# Altium project 18111C Ticketing.PrjPcb
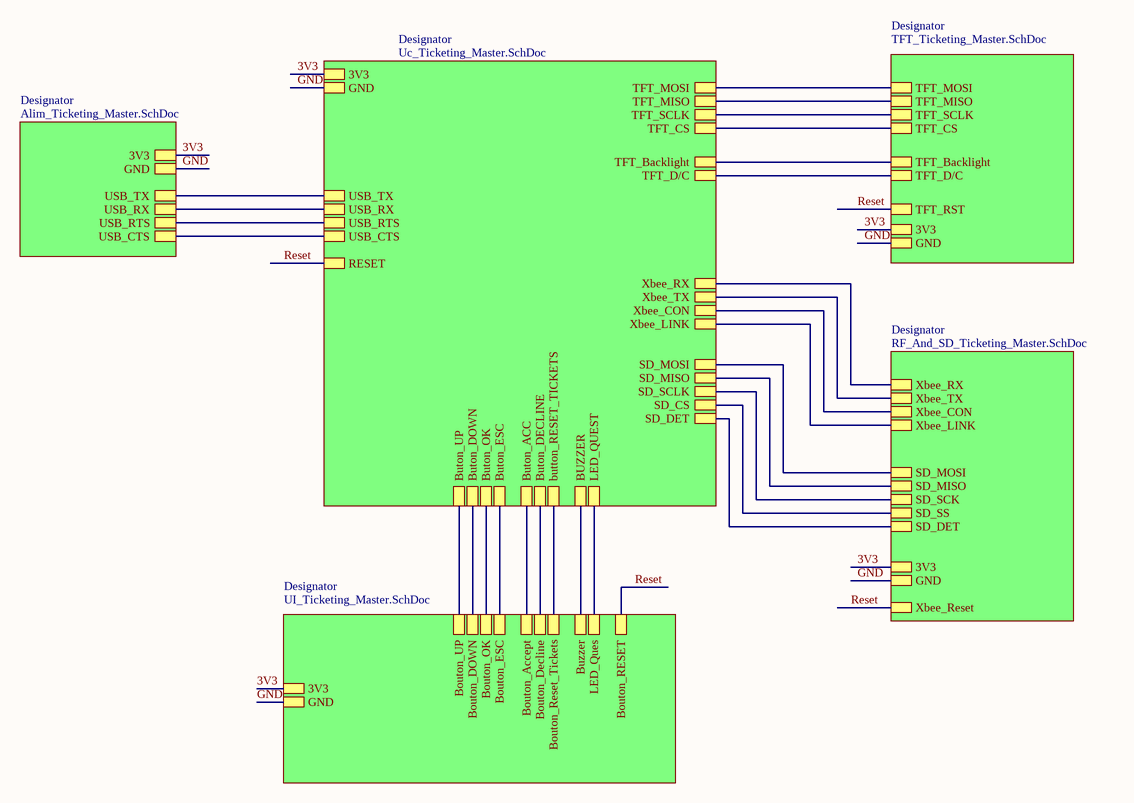
[diagram p0: Ticketing_Master.SchDoc]
6 sheets, 75 parts. Net scope: hierarchical (ports join the sheet entries above them; power ports are global).
Board file: PCB_Ticketing_Master.PcbDoc
Sheets:
  Ticketing_Master.SchDoc
    Designator = Alim_Ticketing_Master.SchDoc
    Designator = RF_And_SD_Ticketing_Master.SchDoc
    Designator = TFT_Ticketing_Master.SchDoc
    Designator = Uc_Ticketing_Master.SchDoc
    Designator = UI_Ticketing_Master.SchDoc

## Sheet Ticketing_Master.SchDoc
size A4; Author: Mario Dos Santos; Organization: ETML-ES; Address1: Avenue Recordon 1; Address2: 1004 Lausanne; Address3: Switzerland; SheetNumber: 1; SheetTotal: 6

### Sub-sheets
Designator = Alim_Ticketing_Master.SchDoc: 3V3, GND, USB_TX, USB_RX, USB_RTS, USB_CTS
Designator = RF_And_SD_Ticketing_Master.SchDoc: Xbee_RX, Xbee_TX, SD_MISO, Xbee_Reset, SD_SS, SD_MOSI, SD_SCK, Xbee_CON, Xbee_LINK, GND, 3V3, SD_DET
Designator = TFT_Ticketing_Master.SchDoc: TFT_MOSI, TFT_Backlight, TFT_CS, TFT_RST, TFT_D/C, TFT_MISO, TFT_SCLK, 3V3, GND
Designator = Uc_Ticketing_Master.SchDoc: 3V3, GND, SD_SCLK, TFT_SCLK, SD_MOSI, SD_MISO, Xbee_RX, Xbee_TX, TFT_MOSI, TFT_MISO, TFT_Backlight, SD_CS, TFT_CS, TFT_D/C, Xbee_CON, Xbee_LINK, Buton_UP, Buton_OK, Buton_ESC, Buton_DOWN, LED_QUEST, BUZZER, Buton_DECLINE, button_RESET_TICKETS, Buton_ACC, RESET, SD_DET, USB_TX, USB_RX, USB_RTS, USB_CTS
Designator = UI_Ticketing_Master.SchDoc: GND, 3V3, Buzzer, Bouton_Accept, Bouton_UP, Bouton_OK, LED_Ques, Bouton_ESC, Bouton_Decline, Bouton_Reset_Tickets, Bouton_DOWN, Bouton_RESET

### Nets
3V3: sheet Designator/3V3, sheet Designator/3V3, sheet Designator/3V3, sheet Designator/3V3, sheet Designator/3V3
GND: sheet Designator/GND, sheet Designator/GND, sheet Designator/GND, sheet Designator/GND, sheet Designator/GND
BackLight: sheet Designator/TFT_Backlight, sheet Designator/TFT_Backlight
Connect(M): sheet Designator/Xbee_CON, sheet Designator/Xbee_CON
CS: sheet Designator/TFT_CS, sheet Designator/TFT_CS
D/C: sheet Designator/TFT_D/C, sheet Designator/TFT_D/C
LED_Ques: sheet Designator/LED_QUEST, sheet Designator/LED_Ques
LINK(M): sheet Designator/Xbee_LINK, sheet Designator/Xbee_LINK
MISO: sheet Designator/TFT_MISO, sheet Designator/TFT_MISO
MOSI: sheet Designator/TFT_MOSI, sheet Designator/TFT_MOSI
Reset: sheet Designator/Xbee_Reset, sheet Designator/TFT_RST, sheet Designator/RESET, sheet Designator/Bouton_RESET
SCLK: sheet Designator/TFT_SCLK, sheet Designator/TFT_SCLK
USB_CTS: sheet Designator/USB_CTS, sheet Designator/USB_CTS
USB_RTS: sheet Designator/USB_RTS, sheet Designator/USB_RTS
USB_RX: sheet Designator/USB_RX, sheet Designator/USB_RX
USB_TX: sheet Designator/USB_TX, sheet Designator/USB_TX
Xbee_RX: sheet Designator/Xbee_RX, sheet Designator/Xbee_RX
Xbee_TX: sheet Designator/Xbee_TX, sheet Designator/Xbee_TX
NetJ3_2: sheet Designator/SD_SS, sheet Designator/SD_CS
NetJ3_3: sheet Designator/SD_MOSI, sheet Designator/SD_MOSI
NetJ3_5: sheet Designator/SD_SCK, sheet Designator/SD_SCLK
NetJ3_7: sheet Designator/SD_MISO, sheet Designator/SD_MISO
NetJ3_9: sheet Designator/SD_DET, sheet Designator/SD_DET
NetQ1_1: sheet Designator/BUZZER, sheet Designator/Buzzer
NetR8_1: sheet Designator/Buton_OK, sheet Designator/Bouton_OK
NetR9_1: sheet Designator/Buton_UP, sheet Designator/Bouton_UP
NetR12_1: sheet Designator/Buton_ESC, sheet Designator/Bouton_ESC
NetR13_1: sheet Designator/Buton_DOWN, sheet Designator/Bouton_DOWN
NetR15_1: sheet Designator/Buton_ACC, sheet Designator/Bouton_Accept
NetR16_1: sheet Designator/Buton_DECLINE, sheet Designator/Bouton_Decline
NetR17_1: sheet Designator/button_RESET_TICKETS, sheet Designator/Bouton_Reset_Tickets

### Notes on the sheet
- Fichier :
- a
- Date :
- Heure :
- Version :
- Auteur :
- Modif.
- b
- c
- d
- Projet :
- No :
- Nb feuilles
- Feuille n°
- Chemin :

## Sheet Alim_Ticketing_Master.SchDoc
size A4; Author: Mario Dos Santos; Organization: ETML-ES; Address1: Avenue Recordon 1; Address2: 1004 Lausanne; Address3: Switzerland; Revision: C; SheetNumber: 2; SheetTotal: 6
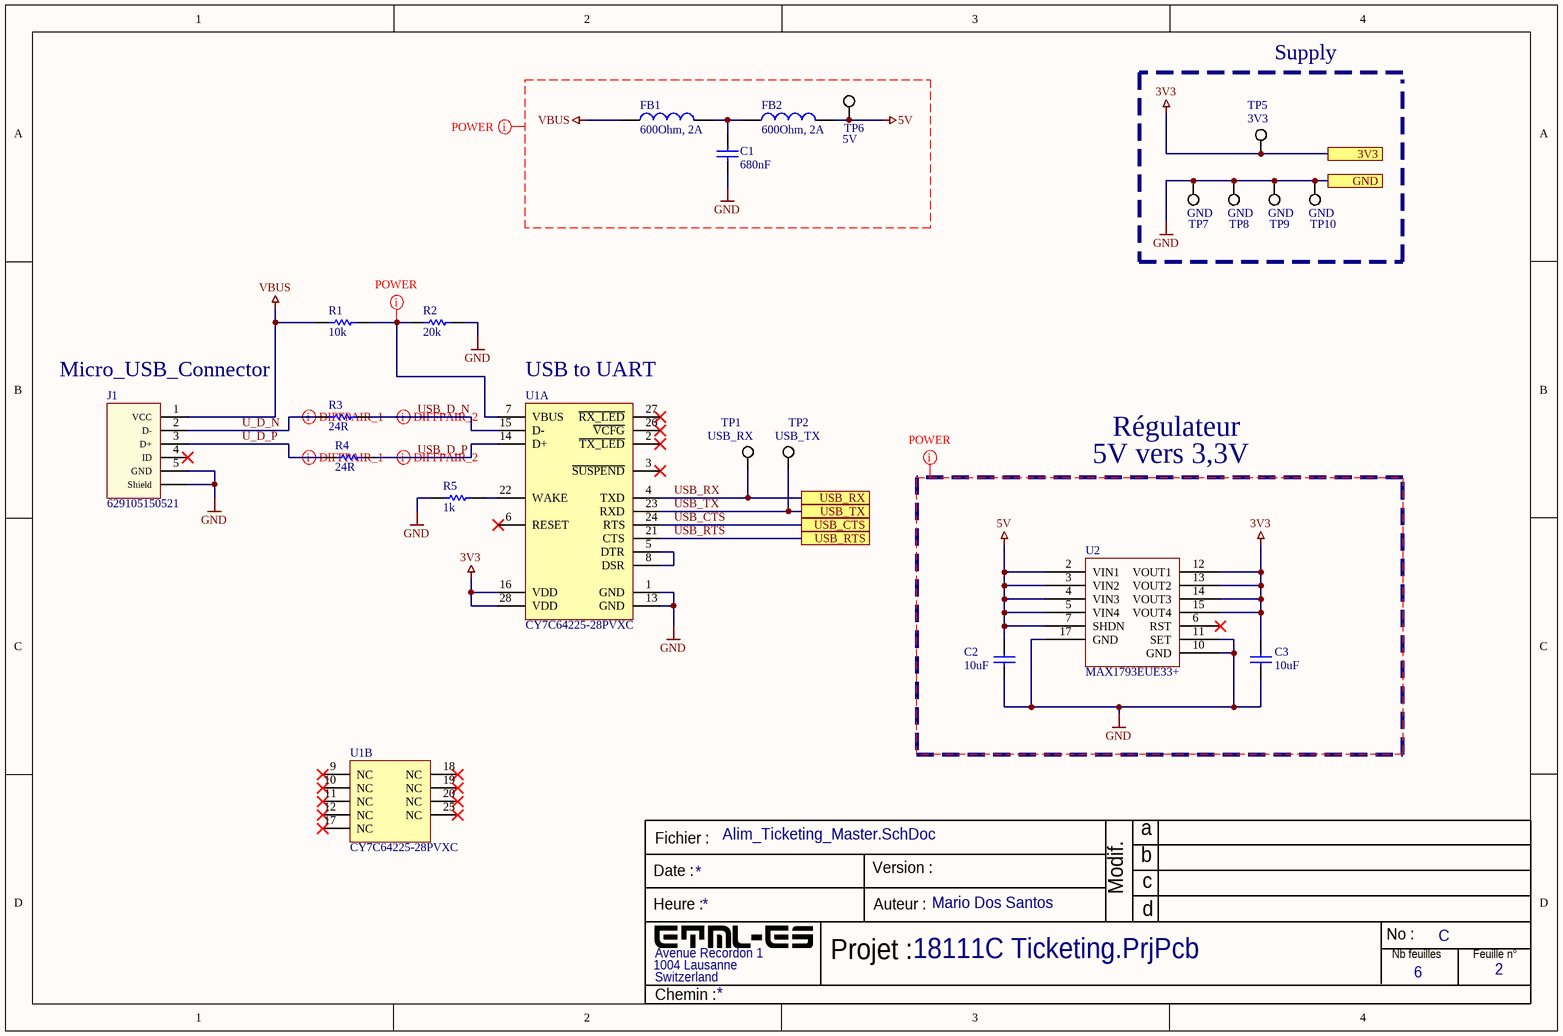
[diagram p1: Alim_Ticketing_Master.SchDoc]

### Parts
C1  680nF  [6-0805_N]
C2  10uF  [6-0805_N]
C3  10uF  [6-0805_N]
FB1  600Ohm, 2A  [WE-CBF_0805_High Current]
FB2  600Ohm, 2A  [WE-CBF_0805_High Current]
J1  629105150521  [629105150521]
R1  10k  [RESC0805(2012)_L]
R2  20k  [RESC0805(2012)_L]
R3  24R  [RESC0805(2012)_L]
R4  24R  [RESC0805(2012)_L]
R5  1k  [RESC0805(2012)_L]
TP1  (no value)  [KSTN-5019_V]
TP2  (no value)  [KSTN-5019_V]
TP5  (no value)  [KSTN-5019_V]
TP6  (no value)  [KSTN-5019_V]
TP7  (no value)  [KSTN-5019_V]
TP8  (no value)  [KSTN-5019_V]
TP9  (no value)  [KSTN-5019_V]
TP10  (no value)  [KSTN-5019_V]
U1  CY7C64225-28PVXC  [CYP-PVX28_N]  (parts A,B of 2)
U2  MAX1793EUE33+  [TSOP65P640X110_HS-17N]

### Blocks framed on the sheet
5V vers 3,3V: C2 C3 U2

### Ports
3V3, GND, USB_CTS, USB_RTS, USB_RX, USB_TX

### Nets
3V3: C3.2 TP5.1 U1.16(VDD) U1.28(VDD) U2.12(VOUT1) U2.13(VOUT2) U2.14(VOUT3) U2.15(VOUT4) ; port 3V3
5V: C2.1 FB2.2 TP6.1 U2.2(VIN1) U2.3(VIN2) U2.4(VIN3) U2.5(VIN4) U2.7(SHDN)
GND: C1.2 C2.2 C3.1 J1.5(GND) J1.Shell(Shield) R2.2 R5.2 TP7.1 TP8.1 TP9.1 TP10.1 U1.1(GND) U1.13(GND) U2.10(GND) U2.11(SET) U2.17(GND) ; port GND
VBUS: FB1.1 J1.1(VCC) R1.1
U_D_N: J1.2(D-) R3.1
U_D_P: J1.3(D+) R4.1
USB_CTS: U1.24(RTS) ; port USB_CTS
USB_D_N: R3.2 U1.15(D-)
USB_D_P: R4.2 U1.14(D+)
USB_RTS: U1.21(CTS) ; port USB_RTS
USB_RX: TP1.1 U1.4(TXD) ; port USB_RX
USB_TX: TP2.1 U1.23(RXD) ; port USB_TX
NetC1_1: C1.1 FB1.2 FB2.1
NetR1_2: R1.2 R2.1 U1.7(VBUS)
NetR5_1: R5.1 U1.22(WAKE)
NetU1_5: U1.5(DTR) U1.8(DSR)

Not connected (* = marked no-connect by the designer): J1 4(ID)*; U1 2(~{TX_LED})* 3(~{SUSPEND})* 6(RESET)* 9(NC)* 10(NC)* 11(NC)* 12(NC)* 17(NC)* 18(NC)* 19(NC)* 20(NC)* 25(NC)* 26(~{VCFG})* 27(~{RX_LED})*; U2 6(RST)*

### Layout directives
differential pair: U_D_N, U_D_P, USB_D_N, USB_D_P
net class POWER: 3V3, 5V, GND, NetR1_2, VBUS

### Notes on the sheet
- Supply
- 5V
- (near TP5) 3V3
- (near TP7) GND
- (near TP8) GND
- (near TP9) GND
- (near TP10) GND
- (near J1) Micro_USB_Connector
- (near U1) USB to UART
- (near TP1) USB_RX
- (near TP2) USB_TX
- Régulateur
- Fichier :
- a
- Date :
- Heure :
- Version :
- Auteur :
- Modif.
- b
- c
- d
- Projet :
- No :
- Nb feuilles
- Feuille n°
- Chemin :

### Library data of the parts
C1 = 885012207098: WCAP-CSGP General Purpose Ceramic Capacitors, size 0805, 100nF, +/-10%, 50VDC; Technical Reference: X7R0805104K050DFCT10000; Capacitance: 680nF; Supplier Part Number 1: 732-7663-1-ND; Value: 680nF; Supplier unit price: 0.13; Supplier: Digi-Key; Supplier Part Number: 732-7663-1-ND
C2 C3 = Cap: Capacitor; Published: 8-Jun-2000; LatestRevisionDate: 17-Jul-2002; LatestRevisionNote: Re-released for DXP Platform.; PackageReference: RAD-0.3; Publisher: Altium Limited; PackageDescription: Radial Cap, Thru-Hole; 2 Leads; 0.3 in Pin Spacing; Value: 10uF; Capacitance: 10uF; Supplier Part Number: 1276-1298-1-ND; Supplier unit price: 0.1; Supplier: Digi-Key
FB1 FB2 = 742792040: WE-CBF SMT EMI Suppression Ferrite Bead, size 0805, 600Ohm, 2A; Impedance max.: 700Ohm; DC Resistance max.: 0.15Ohm; Type: High Current; ComponentLink1Description: Manufacturer; ComponentLink1URL: http://www.we-online.de; ComponentLink2Description: Datasheet; ComponentLink2URL: https://katalog.we-online.com/pbs/datasheet/742792040.pdf; Part Number: 742792040; Published Date: March 2019; Publisher: Wurth Elektronik; Rated Current: 2A; Operating Temperature: -55 to +125degC; Impedance@100 MHz: 600Ohm; Mounting Technology: SMT; Packaging: Tape and Reel; Size: 0805; Supplier Part Number 1: 732-1620-1-ND; Supplier unit price: 0.22; Supplier: Digi-Key; Value: 600Ohm, 2A; Supplier Part Number: 732-1620-1-ND
J1 = 629105150521: Micro USB 2.0 SMT Type B Horizontal 5 Contacts High Current WR-COM; Part Number: 732-5960-1-ND; Interface Type: Type B; Gender: Receptacle; ComponentLink1Description: Manufacturer; ComponentLink1URL: http://www.we-online.de; ComponentLink2Description: Datasheet; ComponentLink2URL: http://katalog.we-online.de/em/datasheet/629105150521.pdf; Published Date: April 2017; Publisher: Wurth Elektronik; Sub-Family: Micro USB 2.0; Type: Horizontal; Construction: SMT; Value: 629105150521; Supplier: Digi-key; Supplier Part Number: 732-5960-1-ND; Supplier unit price: 2.12
R1-R5 = CMP-1013-00122-1: 100K 0.125W 5% 0805 (2012 Metric)  SMD; Case-Metric: 2012; Case-EIA: 0805; Tolerance: 5 %; Technology: SMT; Power: 0.125 W; Supplier: Digi-Key; Supplier unit price: 0.1
  R1: Value: 10k; Supplier Part Number: 311-10KLGCT-ND
  R2: Value: 20k; Supplier Part Number: RNCP0805FTD20K0CT-ND
  R3 R4: Value: 24R; Supplier Part Number: 311-24.0CRCT-ND
  R5: Value: 1k; Supplier Part Number: RNCP0805FTD1K00CT-ND
TP1 TP2 TP5-TP10 = CMP-1672-00008-1: Test Point, 1 Position SMD, RoHS, Tape and Reel; ComponentLink1Description: Manufacturer URL; Package Quantity: 1000; DatasheetVersion: 03/2014; Packaging: Tape and Reel; ComponentLink2URL: http://www.keyelco.com/product-pdf.cfm?p=1357; ComponentLink1URL: http://www.keyelco.com/; Mount: Surface Mount; Contact Plating: Silver; PackageDescription: 1-Pin Surface Mount Device, Body 3.81 x 2.03 mm; Pins: 1; RoHSCompliant: True; Mounting Technology: Surface Mount; ComponentLink2Description: Datasheet; PackageReference: 5019; Supplier: Digi-Key; Supplier Part Number: 36-5019CT-ND; Supplier unit price: 0.33
U1 = CMP-0967-00143-1: USB-to-UART Bridge Controller, 3 to 5.25 V, 0 to 70 degC, 28-Pin SSOP (PVX28), Tube; Manufacturer: Cypress; Part Number: 428-3158-ND; Max. Operating Voltage (V): 5.25; Min. Operating Voltage (V): 3; Memory Architecture: Flash; Mounting Technology: Surface Mount; Max. Operating Temp. (degreesC): 70; DatasheetVersion: Rev. *D; Packing: Tube; ComponentLink2URL: http://www.cypress.com/?docID=48153; PackageReference: PVX28; PartNumber: CY7C64225-28PVXC; PackageDescription: 28-Pin Super Small Outline Package, Body 10.2 x 5.3 mm, Pitch 0.65 mm; RoHS: Pb-Free; ComponentLink3Description: Package Specification; Min. Operating Temp. (degreesC): 0; ComponentLink1URL: http://www.cypress.com/; ComponentLink2Description: Datasheet; ComponentLink1Description: Manufacturer URL; PackageVersion: Rev. *C, 10/2001; ComponentLink3URL: http://www.cypress.com/?docID=1371; Manufacturer Part Number: CY7C64225-28PVXC; Value: CY7C64225-28PVXC; Supplier: Digi-key; Supplier Part Number: 428-3158-ND; Supplier unit price: 3.83
U2 = MAX1793: Supplier Part Number: MAX1793EUE33+-ND; Supplier unit price: 3.92; Value: MAX1793EUE33+; Supplier: Digi-Key

## Sheet RF_And_SD_Ticketing_Master.SchDoc
size A4; Author: Mario Dos Santos; Organization: ETML-ES; Address1: Avenue Recordon 1; Address2: 1004 Lausanne; Address3: Switzerland; Revision: C; SheetNumber: 6; SheetTotal: 6
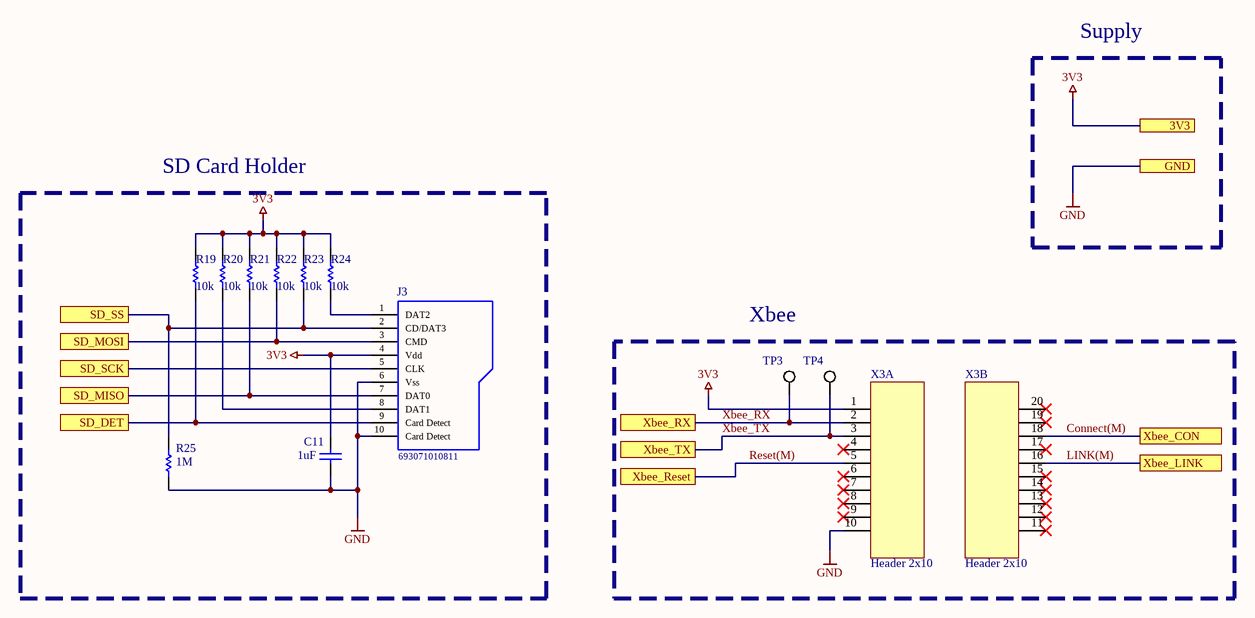
[diagram p2: RF_And_SD_Ticketing_Master.SchDoc]

### Parts
C11  1uF  [6-0805_N]
J3  693071010811  [693071010811]
R19  10k  [RESC0805(2012)_L]
R20  10k  [RESC0805(2012)_L]
R21  10k  [RESC0805(2012)_L]
R22  10k  [RESC0805(2012)_L]
R23  10k  [RESC0805(2012)_L]
R24  10k  [RESC0805(2012)_L]
R25  1M  [RESC0805(2012)_L]
TP3  (no value)  [KSTN-5019_V]
TP4  (no value)  [KSTN-5019_V]
X3  Header 2x10  [ZB-SB]  (parts A,B of 2)

### Blocks framed on the sheet
SD Card Holder: C11 J3 R19-R25
Xbee: TP3 TP4 X3

### Ports
3V3, GND, SD_DET, SD_MISO, SD_MOSI, SD_SCK, SD_SS, Xbee_CON, Xbee_LINK, Xbee_Reset, Xbee_RX, Xbee_TX

### Nets
3V3: C11.2 J3.4(Vdd) R19.2 R20.2 R21.2 R22.2 R23.2 R24.2 X3.1 ; port 3V3
GND: C11.1 J3.6(Vss) J3.10(Card_Detect) R25.1 X3.10 ; port GND
Connect(M): X3.18 ; port Xbee_CON
LINK(M): X3.16 ; port Xbee_LINK
Reset(M): X3.5 ; port Xbee_Reset  [project net Reset]
Xbee_RX: TP3.1 X3.2 ; port Xbee_RX
Xbee_TX: TP4.1 X3.3 ; port Xbee_TX
NetJ3_1: J3.1(DAT2) R24.1
NetJ3_2: J3.2(CD/DAT3) R23.1 R25.2 ; port SD_SS
NetJ3_3: J3.3(CMD) R22.1 ; port SD_MOSI
NetJ3_5: J3.5(CLK) ; port SD_SCK
NetJ3_7: J3.7(DAT0) R21.1 ; port SD_MISO
NetJ3_8: J3.8(DAT1) R20.1
NetJ3_9: J3.9(Card_Detect) R19.1 ; port SD_DET

Not connected (* = marked no-connect by the designer): X3 4* 6* 7* 8* 9* 11* 12* 13* 14* 15* 17* 19* 20*

### Notes on the sheet
- Supply
- Fichier :
- a
- Date :
- Heure :
- Version :
- Auteur :
- Modif.
- b
- c
- d
- Projet :
- No :
- Nb feuilles
- Feuille n°
- Chemin :

### Library data of the parts
C11 = Cap: Capacitor; Published: 8-Jun-2000; LatestRevisionDate: 17-Jul-2002; LatestRevisionNote: Re-released for DXP Platform.; PackageReference: RAD-0.3; Publisher: Altium Limited; PackageDescription: Radial Cap, Thru-Hole; 2 Leads; 0.3 in Pin Spacing; Value: 1uF; Supplier Part Number: 1276-2931-1-ND; Supplier unit price: 0.1; Supplier: Digi-Key
J3 = 693071010811: WR-CRD Micro SD Card Connector, Push & Push, with card detection; Part Number: 732-3819-1-ND; Rated Current: 0.5A; Working Voltage: 500V AC; ComponentLink1Description: Manufacturer; ComponentLink1URL: http://www.we-online.de; ComponentLink2Description: Datasheet; ComponentLink2URL: http://katalog.we-online.de/em/datasheet/693071010811.pdf; Published Date: Feb. 2018; Publisher: Wurth Elektronik; Operating Temperature: -25 to 85 degC; Mounting Technology: SMT; Value: 693071010811; Supplier: Digi-Key; Supplier Part Number: 732-3819-1-ND; Supplier unit price: 2.99
R19-R25 = CMP-1013-00122-1: as R1 on sheet Alim_Ticketing_Master; Tolerance: 5 %; Technology: SMT; Power: 0.125 W; Supplier: Digi-Key; Supplier unit price: 0.1
  R19-R24: Value: 10k; Supplier Part Number: 311-10KLGCT-ND
  R25: Value: 1M; Supplier Part Number: YAG3704CT-ND
TP3 TP4 = CMP-1672-00008-1: as TP1 on sheet Alim_Ticketing_Master; ComponentLink1Description: Manufacturer URL; Package Quantity: 1000; DatasheetVersion: 03/2014; Packaging: Tape and Reel; ComponentLink2URL: http://www.keyelco.com/product-pdf.cfm?p=1357; ComponentLink1URL: http://www.keyelco.com/; Mount: Surface Mount; Contact Plating: Silver; PackageDescription: 1-Pin Surface Mount Device, Body 3.81 x 2.03 mm; Pins: 1; RoHSCompliant: True; Mounting Technology: Surface Mount; ComponentLink2Description: Datasheet; PackageReference: 5019; Supplier: Digi-Key; Supplier Part Number: 36-5019CT-ND
X3 = HDR ZB-SB 2x10_1: Header 2x10 / Xbee de letml(1623) ou xbee XB24CAUIT-001; Value: Header 2x10; Supplier: Digi-Key

## Sheet TFT_Ticketing_Master.SchDoc
size A4; Author: Mario Dos Santos; Organization: ETML-ES; Address1: Avenue Recordon 1; Address2: 1004 Lausanne; Address3: Switzerland; Revision: C; SheetNumber: 4; SheetTotal: 6
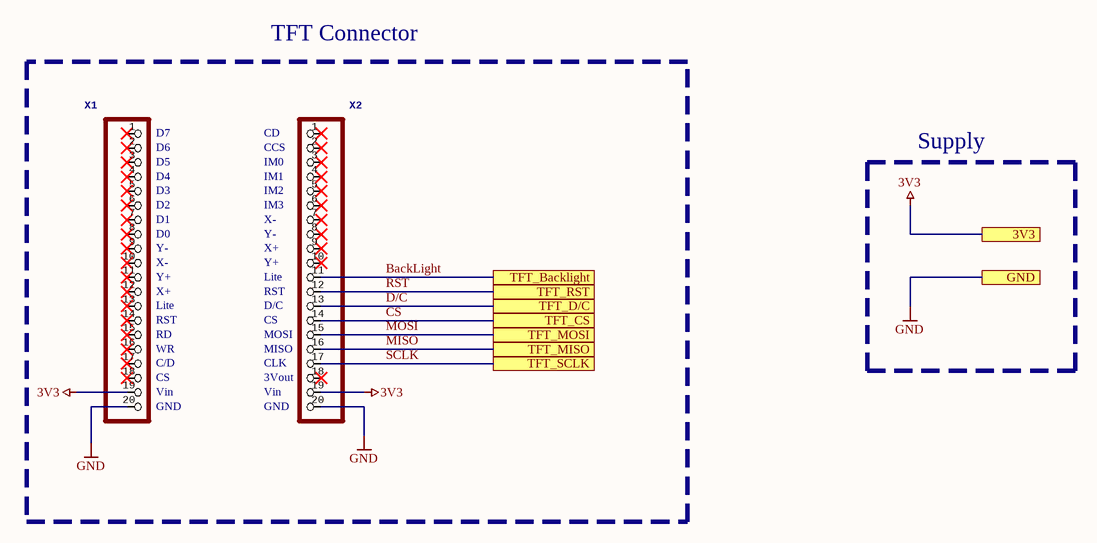
[diagram p3: TFT_Ticketing_Master.SchDoc]

### Parts
X1  HEADER-1X20ROUND  [HDR1X20]  (value not drawn)
X2  HEADER-1X20ROUND  [HDR1X20]  (value not drawn)

### Blocks framed on the sheet
TFT Connector: X1 X2

### Ports
3V3, GND, TFT_Backlight, TFT_CS, TFT_D/C, TFT_MISO, TFT_MOSI, TFT_RST, TFT_SCLK

### Nets
3V3: X1.19 X2.19 ; port 3V3
GND: X1.20 X2.20 ; port GND
BackLight: X2.11 ; port TFT_Backlight
CS: X2.14 ; port TFT_CS
D/C: X2.13 ; port TFT_D/C
MISO: X2.16 ; port TFT_MISO
MOSI: X2.15 ; port TFT_MOSI
RST: X2.12 ; port TFT_RST  [project net Reset]
SCLK: X2.17 ; port TFT_SCLK

Not connected (* = marked no-connect by the designer): X1 1* 2* 3* 4* 5* 6* 7* 8* 9* 10* 11* 12* 13* 14* 15* 16* 17* 18*; X2 1* 2* 3* 4* 5* 6* 7* 8* 9* 10* 18*

### Notes on the sheet
- (near X1) D7
- (near X1) D6
- (near X2) CD
- (near X2) CCS
- Supply
- (near X1) D5
- (near X1) D4
- (near X1) D3
- (near X1) D2
- (near X1) D1
- (near X1) D0
- (near X2) IM0
- (near X2) IM1
- (near X2) IM2
- (near X2) IM3
- (near X2) X-
- (near X2) Y-
- (near X1) Y-
- (near X1) X-
- (near X1) Y+
- (near X1) X+
- (near X2) X+
- (near X2) Y+
- (near X2) Lite
- (near X2) RST
- (near X1) Lite
- (near X1) RST
- (near X1) RD
- (near X1) WR
- (near X1) C/D
- (near X1) CS
- (near X2) D/C
- (near X2) CS
- (near X2) MOSI
- (near X2) MISO
- (near X2) CLK
- (near X2) 3Vout
- (near X1) Vin
- (near X1) GND
- (near X2) Vin
- (near X2) GND
- Fichier :
- a
- Date :
- Heure :
- Version :
- Auteur :
- Modif.
- b
- c
- d
- Projet :
- No :
- Nb feuilles
- Feuille n°
- Chemin :

### Library data of the parts
X1 = HEADER-1X20ROUND: Con_TFT_Gauche; Value: HEADER-1X20ROUND; Supplier: Digi-Key
X2 = HEADER-1X20ROUND: Con_TFT_Droite; Value: HEADER-1X20ROUND; Supplier: Digi-Key

## Sheet Uc_Ticketing_Master.SchDoc
size A4; Author: Mario Dos Santos; Organization: ETML-ES; Address1: Avenue Recordon 1; Address2: 1004 Lausanne; Address3: Switzerland; Revision: C; SheetNumber: 3; SheetTotal: 6
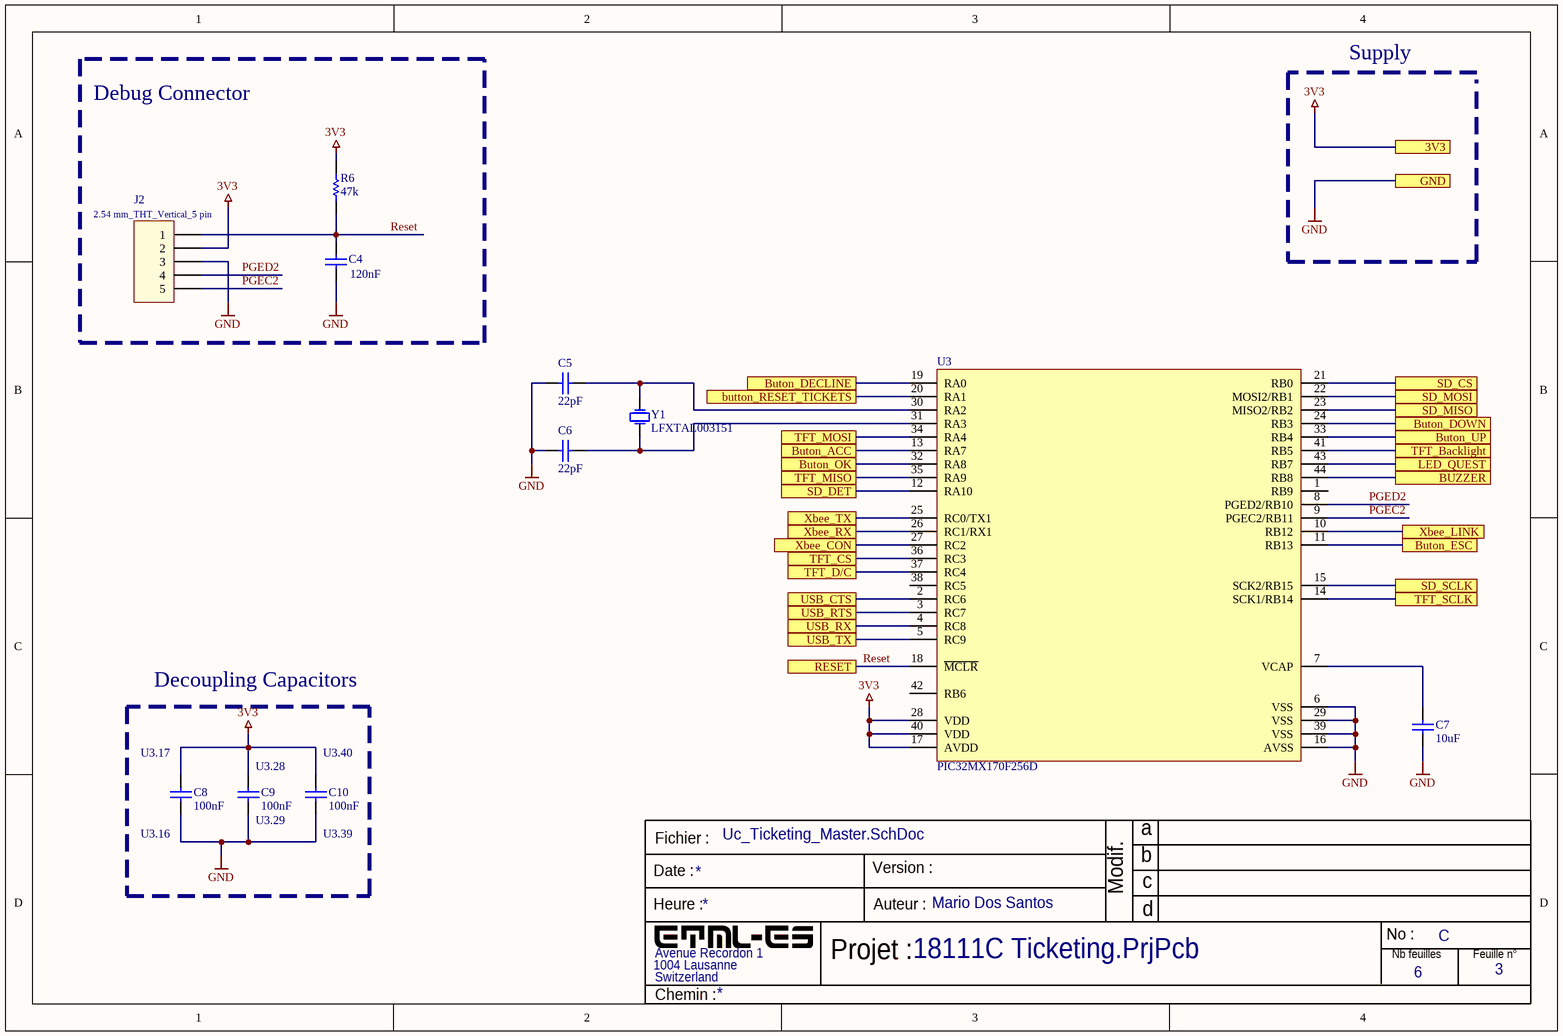
[diagram p4: Uc_Ticketing_Master.SchDoc]

### Parts
C4  120nF  [6-0805_N]
C5  22pF  [6-0805_N]
C6  22pF  [6-0805_N]
C7  10uF  [6-0805_N]
C8  100nF  [6-0805_N]
C9  100nF  [6-0805_N]
C10  100nF  [6-0805_N]
J2  2.54 mm_THT_Vertical_5 pin  [61300511121]
R6  47k  [RESC0805(2012)_L]
U3  PIC32MX170F256D  [MCHP-TQFP-PT44_N]
Y1  LFXTAL003151  [LFXTAL003151REEL]

### Blocks framed on the sheet
Debug Connector: C4 J2 R6
Decoupling Capacitors: C8-C10

### Ports
3V3, Buton_ACC, Buton_DECLINE, Buton_DOWN, Buton_ESC, Buton_OK, Buton_UP, button_RESET_TICKETS, BUZZER, GND, LED_QUEST, RESET, SD_CS, SD_DET, SD_MISO, SD_MOSI, SD_SCLK, TFT_Backlight, TFT_CS, TFT_D/C, TFT_MISO, TFT_MOSI, TFT_SCLK, USB_CTS, USB_RTS, USB_RX, USB_TX, Xbee_CON, Xbee_LINK, Xbee_RX, Xbee_TX

### Nets
3V3: C8.2 C9.2 C10.2 J2.2 R6.1 U3.17(AVDD) U3.28(VDD) U3.40(VDD) ; port 3V3
GND: C4.1 C5.1 C6.1 C7.1 C8.1 C9.1 C10.1 J2.3 U3.6(VSS) U3.16(AVSS) U3.29(VSS) U3.39(VSS) ; port GND
BackLight: U3.41(RB5) ; port TFT_Backlight
Connect(M): U3.27(RC2) ; port Xbee_CON
CS: U3.36(RC3) ; port TFT_CS
D/C: U3.37(RC4) ; port TFT_D/C
LED_Ques: U3.43(RB7) ; port LED_QUEST
LINK(M): U3.10(RB12) ; port Xbee_LINK
MISO: U3.35(RA9) ; port TFT_MISO
MOSI: U3.34(RA4) ; port TFT_MOSI
PGEC2: J2.5 U3.9(PGEC2/RB11)
PGED2: J2.4 U3.8(PGED2/RB10)
Reset: C4.2 J2.1 R6.2 U3.18(~{MCLR}) ; port RESET
SCLK: U3.14(SCK1/RB14) ; port TFT_SCLK
USB_CTS: U3.2(RC6) ; port USB_CTS
USB_RTS: U3.3(RC7) ; port USB_RTS
USB_RX: U3.4(RC8) ; port USB_RX
USB_TX: U3.5(RC9) ; port USB_TX
Xbee_RX: U3.26(RC1/RX1) ; port Xbee_RX
Xbee_TX: U3.25(RC0/TX1) ; port Xbee_TX
NetC5_2: C5.2 U3.30(RA2) Y1.1
NetC6_2: C6.2 U3.31(RA3) Y1.2
NetC7_2: C7.2 U3.7(VCAP)
NetJ3_2: U3.21(RB0) ; port SD_CS
NetJ3_3: U3.22(MOSI2/RB1) ; port SD_MOSI
NetJ3_5: U3.15(SCK2/RB15) ; port SD_SCLK
NetJ3_7: U3.23(MISO2/RB2) ; port SD_MISO
NetJ3_9: U3.12(RA10) ; port SD_DET
NetQ1_1: U3.44(RB8) ; port BUZZER
NetR8_1: U3.32(RA8) ; port Buton_OK
NetR9_1: U3.33(RB4) ; port Buton_UP
NetR12_1: U3.11(RB13) ; port Buton_ESC
NetR13_1: U3.24(RB3) ; port Buton_DOWN
NetR15_1: U3.13(RA7) ; port Buton_ACC
NetR16_1: U3.19(RA0) ; port Buton_DECLINE
NetR17_1: U3.20(RA1) ; port button_RESET_TICKETS

Not connected (* = marked no-connect by the designer): U3 1(RB9) 38(RC5) 42(RB6)

### Notes on the sheet
- Supply
- (near C8) U3.17
- (near C9) U3.28
- (near C10) U3.40
- (near C8) U3.16
- (near C9) U3.29
- (near C10) U3.39
- Fichier :
- a
- Date :
- Heure :
- Version :
- Auteur :
- Modif.
- b
- c
- d
- Projet :
- No :
- Nb feuilles
- Feuille n°
- Chemin :

### Library data of the parts
C4 C7-C10 = Cap: Capacitor; Supplier: Digi-Key
  C4: Value: 120nF; Supplier Part Number: 311-4323-1-ND; Supplier unit price: 0.18
  C7: Value: 10uF; Supplier Part Number: 1276-1298-1-ND; Supplier unit price: 0.1
  C8-C10: Value: 100nF; Supplier Part Number: 399-C0805C104M5RAC7800CT-ND; Supplier unit price: 0.1
C5 C6 = CMP-2007-03167-1: VJ0805Y104KNAAT; Supplier: Digi-Key; Supplier Part Number: 399-C0805C220J5GAC7800CT-ND; Supplier unit price: 0.1; Value: 22pF
J2 = 61300511121: Pin Header WR-PHD, pitch 2.54 mm, THT, Vertical, single row, 5 pin; Supplier: Digi-Key; Supplier Part Number: 732-5318-ND; Supplier unit price: 0.25; Value: 2.54 mm_THT_Vertical_5 pin
R6 = CMP-1013-00122-1: 100K 0.125W 5% 0805 (2012 Metric)  SMD; Value: 47k; Supplier: Digi-Key; Supplier Part Number: A130144CT-ND; Supplier unit price: 0.1
U3 = MCHP-PIC32MX2XXFXXXD-TQFP-44: Supplier: Digi-Key; Supplier Part Number: PIC32MX170F256D-I/PT-ND; Supplier unit price: 5.43
Y1 = LFXTAL003151REEL: Crystal or Oscillator; Frequency: 8MHz; Supplier: Farnell; Supplier Part Number: 9713794; Supplier unit price: 0.392; Value: LFXTAL003151

## Sheet UI_Ticketing_Master.SchDoc
size A4; Author: Mario Dos Santos; Organization: ETML-ES; Address1: Avenue Recordon 1; Address2: 1004 Lausanne; Address3: Switzerland; Revision: C; SheetNumber: 5; SheetTotal: 6
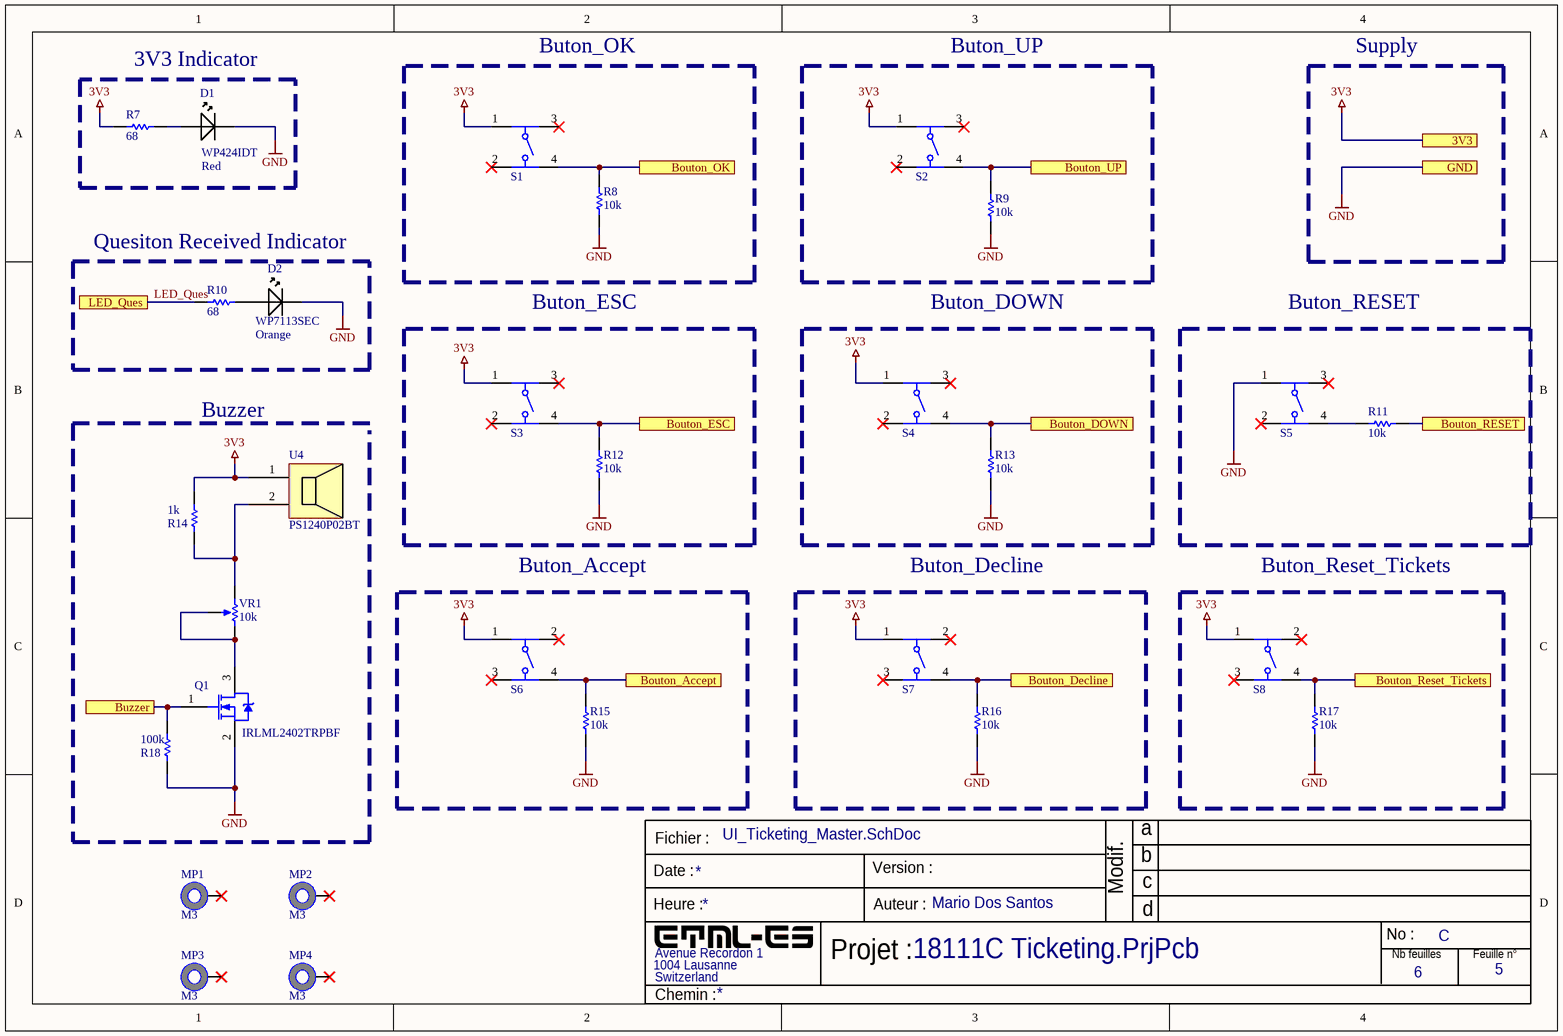
[diagram p5: UI_Ticketing_Master.SchDoc]

### Parts
D1  WP424IDT  Color: Red  [LED-2P-2.28-3MM]
D2  WP7113SEC  Color: Orange  [Type 5mm]
MP1  M3  [9774010151]
MP2  M3  [9774010151]
MP3  M3  [9774010151]
MP4  M3  [9774010151]
Q1  IRLML2402TRPBF  [INTR-IRLML2402TRPBF-3_V]
R7  68  [RESC0805(2012)_L]
R8  10k  [RESC0805(2012)_L]
R9  10k  [RESC0805(2012)_L]
R10  68  [RESC0805(2012)_L]
R11  10k  [RESC0805(2012)_L]
R12  10k  [RESC0805(2012)_L]
R13  10k  [RESC0805(2012)_L]
R14  1k  [RESC2013X60X35ML10T20]
R15  10k  [RESC0805(2012)_L]
R16  10k  [RESC0805(2012)_L]
R17  10k  [RESC0805(2012)_L]
R18  100k  [RESC2013X60X35ML10T20]
S1  430152095826  [430152095826]  (value not drawn)
S2  430152095826  [430152095826]  (value not drawn)
S3  430152095826  [430152095826]  (value not drawn)
S4  430152095826  [430152095826]  (value not drawn)
S5  430182050816  [430182050816]  (value not drawn)
S6  430466073726  [4304x60737x6_12x12x7.3]  (value not drawn)
S7  430466073726  [4304x60737x6_12x12x7.3]  (value not drawn)
S8  430466073726  [4304x60737x6_12x12x7.3]  (value not drawn)
U4  PS1240P02BT  [Buzzer]
VR1  10k  [BOUR-3362P]

### Blocks framed on the sheet
3V3 Indicator: D1 R7
Buton_OK: R8 S1
Buton_UP: R9 S2
Quesiton Received Indicator: D2 R10
Buton_ESC: R12 S3
Buton_DOWN: R13 S4
Buton_RESET: R11 S5
Buton_Accept: R15 S6
Buton_Decline: R16 S7
Buton_Reset_Tickets: R17 S8

### Ports
3V3, Bouton_Accept, Bouton_Decline, Bouton_DOWN, Bouton_ESC, Bouton_OK, Bouton_RESET, Bouton_Reset_Tickets, Bouton_UP, Buzzer, GND, LED_Ques

### Nets
3V3: R7.2 R14.2 S1.1 S2.1 S3.1 S4.1 S6.1 S7.1 S8.1 U4.1 ; port 3V3
GND: D1.2(Cathode) D2.1(Cathode) Q1.2(S) R8.2 R9.2 R12.2 R13.2 R15.2 R16.2 R17.2 R18.1 S5.1 ; port GND
LED_Ques: R10.2 ; port LED_Ques
Reset: R11.2 ; port Bouton_RESET
NetD1_1: D1.1(Anode) R7.1
NetD2_2: D2.2(Anode) R10.1
NetQ1_1: Q1.1(G) R18.2 ; port Buzzer
NetQ1_3: Q1.3(D) VR1.2(S) VR1.3(CW)
NetR8_1: R8.1 S1.4 ; port Bouton_OK
NetR9_1: R9.1 S2.4 ; port Bouton_UP
NetR11_1: R11.1 S5.4
NetR12_1: R12.1 S3.4 ; port Bouton_ESC
NetR13_1: R13.1 S4.4 ; port Bouton_DOWN
NetR14_1: R14.1 U4.2 VR1.1(CCW)
NetR15_1: R15.1 S6.4 ; port Bouton_Accept
NetR16_1: R16.1 S7.4 ; port Bouton_Decline
NetR17_1: R17.1 S8.4 ; port Bouton_Reset_Tickets

Not connected (* = marked no-connect by the designer): MP1 1*; MP2 1*; MP3 1*; MP4 1*; S1 2* 3*; S2 2* 3*; S3 2* 3*; S4 2* 3*; S5 2* 3*; S6 2* 3*; S7 2* 3*; S8 2* 3*

### Notes on the sheet
- Supply
- Buzzer
- Fichier :
- a
- Date :
- Heure :
- Version :
- Auteur :
- Modif.
- b
- c
- d
- Projet :
- No :
- Nb feuilles
- Feuille n°
- Chemin :

### Library data of the parts
D1 D2 = LED: Supplier: Digi-Key; Supplier unit price: 0.4
  D1: Supplier Part Number: 754-1305-ND; Value: WP424IDT
  D2: Supplier A: *; Supplier B: *; Supplier A Ref: 754-1271-ND; Supplier B Ref: *; Manufacturer URL: *; Manufacturer Ref: *; Package: *; Value: WP7113SEC; Supplier Part Number: 754-1271-ND
MP1-MP4 = 9774010151: WA-SMSI SMT Steel Spacer, M2.5 Thread Internal, Length 1mm; Supplier: Digi-Key
Q1 = CMP-2000-05155-1: HEXFET(R) Power MOSFET, N-Channel, 20 V, 1.2 A, 3-Pin SOT-23, RoHS, Tape and Reel; Manufacturer: Infineon Technologies; PartNumber: IRLML2402TRBF; PackageCase: SOT-23; Supplier: Digi-key; Supplier PN: IRLML2402PBFCT-ND; Value: IRLML2402TRPBF; Supplier Part Number: IRLML2402PBFCT-ND; Supplier unit price: 0.41
R7 = CMP-1013-00122-1: 100K 0.125W 5% 0805 (2012 Metric)  SMD; Value: 68; Supplier: Digi-Key; Supplier Part Number: RMCF0805JT68R0CT-ND; Supplier unit price: 0.1
R8-R13 R15-R17 = CMP-1013-00122-1: as R1 on sheet Alim_Ticketing_Master; Tolerance: 5 %; Technology: SMT; Power: 0.125 W; Supplier: Digi-Key; Supplier unit price: 0.1
  R8 R9 R11-R13 R15-R17: Value: 10k; Supplier Part Number: 311-10KLGCT-ND
  R10: Value: 68; Supplier Part Number: RMCF0805JT68R0C  T-ND
R14 = CMP-2100-03671-1: Chip Resistor, 1 KOhm, +/- 1%, 125 mW, -55 to 155 degC, 0805 (2012 Metric), RoHS, Tape and Reel; Voltage Rating: 150V; PackageCase: 0805; Value: 1k; Supplier: Digi-Key; Supplier Part Number: YAG3703CT-ND; Supplier unit price: 0.1
R18 = CMP-2100-03671-1: Chip Resistor, 100 KOhm, +/- 1%, 125 mW, -55 to 155 degC, 0805 (2012 Metric), RoHS, Tape and Reel; Voltage Rating: 150V; PackageCase: 0805; Value: 100k; Supplier: Digi-Key; Supplier Part Number: YAG3688CT-ND; Supplier unit price: 0.1
S1-S4 = 430152095826: 6x6mm SMD Tact Switch WS-TASV, height 9.5 mm, 260 gf; Part Number: 732-6999-1-ND; Rated Current: 50 mA; Operation Force: 260 gf; Rated Voltage: 12 VDC; ComponentLink1Description: Manufacturer; ComponentLink1URL: http://www.we-online.de; ComponentLink2Description: Datasheet; ComponentLink2URL: http://katalog.we-online.de/em/datasheet/4301x2xxx8x6.pdf; Published Date: Nov. 2017; Publisher: Wurth Elektronik; Life Cycle: 200000; Operating Temperature: -40 to +85 degC; Size: 6x6x9.5 mm; Value: 430152095826; Supplier: Digi-Key; Supplier Part Number: 732-6999-1-ND; Supplier unit price: 0.51
S5 = 430182050816: 6x6mm SMD Tact Switch WS-TASV, height 5 mm, 160 gf; Part Number: 732-7005-1-ND; Rated Current: 50 mA; Operation Force: 160 gf; Rated Voltage: 12 VDC; ComponentLink1Description: Manufacturer; ComponentLink1URL: http://www.we-online.de; ComponentLink2Description: Datasheet; ComponentLink2URL: http://katalog.we-online.de/em/datasheet/4301x2xxx8x6.pdf; Published Date: Nov. 2017; Publisher: Wurth Elektronik; Life Cycle: 1000000; Operating Temperature: -40 to +85 degC; Size: 6x6x5 mm; Value: 430182050816; Supplier: Digi-Key; Supplier Part Number: 732-7005-1-ND; Supplier unit price: 0.51
S6-S8 = 430466073726: WS-TATV 12x12mm washable Tact Switch, THT version; Part Number: 430466073726-ND; Operation Force: 260g; ComponentLink1Description: Manufacturer; ComponentLink1URL: http://www.we-online.de; ComponentLink2Description: Datasheet; ComponentLink2URL: http://katalog.we-online.de/em/datasheet/4304x60737x6.pdf; Published Date: June 2017; Publisher: Wurth Elektronik; Size: 12x12x7.3 mm; Life Cycle: 300000 cycles; Value: 430466073726; Supplier: Digi-Key; Supplier Part Number: 430466073726-ND; Supplier unit price: 0.56
U4 = BZR: Buzzer 12mm piezo; Manufacturer: TDK Corporation; Value: PS1240P02BT; Supplier: Digi-Key; Supplier Part Number: 445-2525-1-ND; Supplier unit price: 0.6
VR1 = CMP-1747-00003-1: Square Trimpot(R) Trimming Potentiometer, 100 KOhm, 300 V, -55 to 125 degC, 3-Pin THD, RoHS, Tube; Part Number: 3362P-103LF-ND; Voltage Rating: 250 V; Case\Package: Axial; Tolerance: 1%; Power Rating: 250 mW; RoHSCompliant: true; ComponentLink2URL: http://www.bourns.com/docs/Product-Datasheets/3362.pdf; ComponentLink1Description: Manufacturer URL; DatasheetVersion: May-16; Package Quantity: 200; ComponentLink2Description: Datasheet; Min Operating Temperature: -55 degC; Resistance: 10k; Mount: Through Hole; PackageDescription: 3-Pin Through Hole Device, Body 6.6 x 6.99 mm, Pitch 2.54 mm; Length: 0.248 inch; ComponentLink1URL: http://www.bourns.com/; PackageReference: 3326P; Max Operating Temperature: 155 degC; Packaging: Bulk; Value: 10k; Supplier: Digi-Key; Supplier Part Number: 3362P-103LF-ND; Supplier unit price: 0.99

## Nets that join several sheets
3V3: Alim_Ticketing_Master (8 pins), RF_And_SD_Ticketing_Master (9 pins), TFT_Ticketing_Master (X1.19 X2.19), Uc_Ticketing_Master (8 pins), UI_Ticketing_Master (10 pins)
GND: Alim_Ticketing_Master (16 pins), RF_And_SD_Ticketing_Master (5 pins), TFT_Ticketing_Master (X1.20 X2.20), Uc_Ticketing_Master (12 pins), UI_Ticketing_Master (12 pins)
BackLight: TFT_Ticketing_Master (X2.11), Uc_Ticketing_Master (U3.41)
Connect(M): RF_And_SD_Ticketing_Master (X3.18), Uc_Ticketing_Master (U3.27)
CS: TFT_Ticketing_Master (X2.14), Uc_Ticketing_Master (U3.36)
D/C: TFT_Ticketing_Master (X2.13), Uc_Ticketing_Master (U3.37)
LED_Ques: Uc_Ticketing_Master (U3.43), UI_Ticketing_Master (R10.2)
LINK(M): RF_And_SD_Ticketing_Master (X3.16), Uc_Ticketing_Master (U3.10)
MISO: TFT_Ticketing_Master (X2.16), Uc_Ticketing_Master (U3.35)
MOSI: TFT_Ticketing_Master (X2.15), Uc_Ticketing_Master (U3.34)
NetJ3_2: RF_And_SD_Ticketing_Master (J3.2 R23.1 R25.2), Uc_Ticketing_Master (U3.21)
NetJ3_3: RF_And_SD_Ticketing_Master (J3.3 R22.1), Uc_Ticketing_Master (U3.22)
NetJ3_5: RF_And_SD_Ticketing_Master (J3.5), Uc_Ticketing_Master (U3.15)
NetJ3_7: RF_And_SD_Ticketing_Master (J3.7 R21.1), Uc_Ticketing_Master (U3.23)
NetJ3_9: RF_And_SD_Ticketing_Master (J3.9 R19.1), Uc_Ticketing_Master (U3.12)
NetQ1_1: Uc_Ticketing_Master (U3.44), UI_Ticketing_Master (Q1.1 R18.2)
NetR8_1: Uc_Ticketing_Master (U3.32), UI_Ticketing_Master (R8.1 S1.4)
NetR9_1: Uc_Ticketing_Master (U3.33), UI_Ticketing_Master (R9.1 S2.4)
NetR12_1: Uc_Ticketing_Master (U3.11), UI_Ticketing_Master (R12.1 S3.4)
NetR13_1: Uc_Ticketing_Master (U3.24), UI_Ticketing_Master (R13.1 S4.4)
NetR15_1: Uc_Ticketing_Master (U3.13), UI_Ticketing_Master (R15.1 S6.4)
NetR16_1: Uc_Ticketing_Master (U3.19), UI_Ticketing_Master (R16.1 S7.4)
NetR17_1: Uc_Ticketing_Master (U3.20), UI_Ticketing_Master (R17.1 S8.4)
Reset: RF_And_SD_Ticketing_Master (X3.5), TFT_Ticketing_Master (X2.12), Uc_Ticketing_Master (C4.2 J2.1 R6.2 U3.18), UI_Ticketing_Master (R11.2)
SCLK: TFT_Ticketing_Master (X2.17), Uc_Ticketing_Master (U3.14)
USB_CTS: Alim_Ticketing_Master (U1.24), Uc_Ticketing_Master (U3.2)
USB_RTS: Alim_Ticketing_Master (U1.21), Uc_Ticketing_Master (U3.3)
USB_RX: Alim_Ticketing_Master (TP1.1 U1.4), Uc_Ticketing_Master (U3.4)
USB_TX: Alim_Ticketing_Master (TP2.1 U1.23), Uc_Ticketing_Master (U3.5)
Xbee_RX: RF_And_SD_Ticketing_Master (TP3.1 X3.2), Uc_Ticketing_Master (U3.26)
Xbee_TX: RF_And_SD_Ticketing_Master (TP4.1 X3.3), Uc_Ticketing_Master (U3.25)